# EAGLE design RJ11_BoshBaro_SiHyg (EAGLE 6.3)
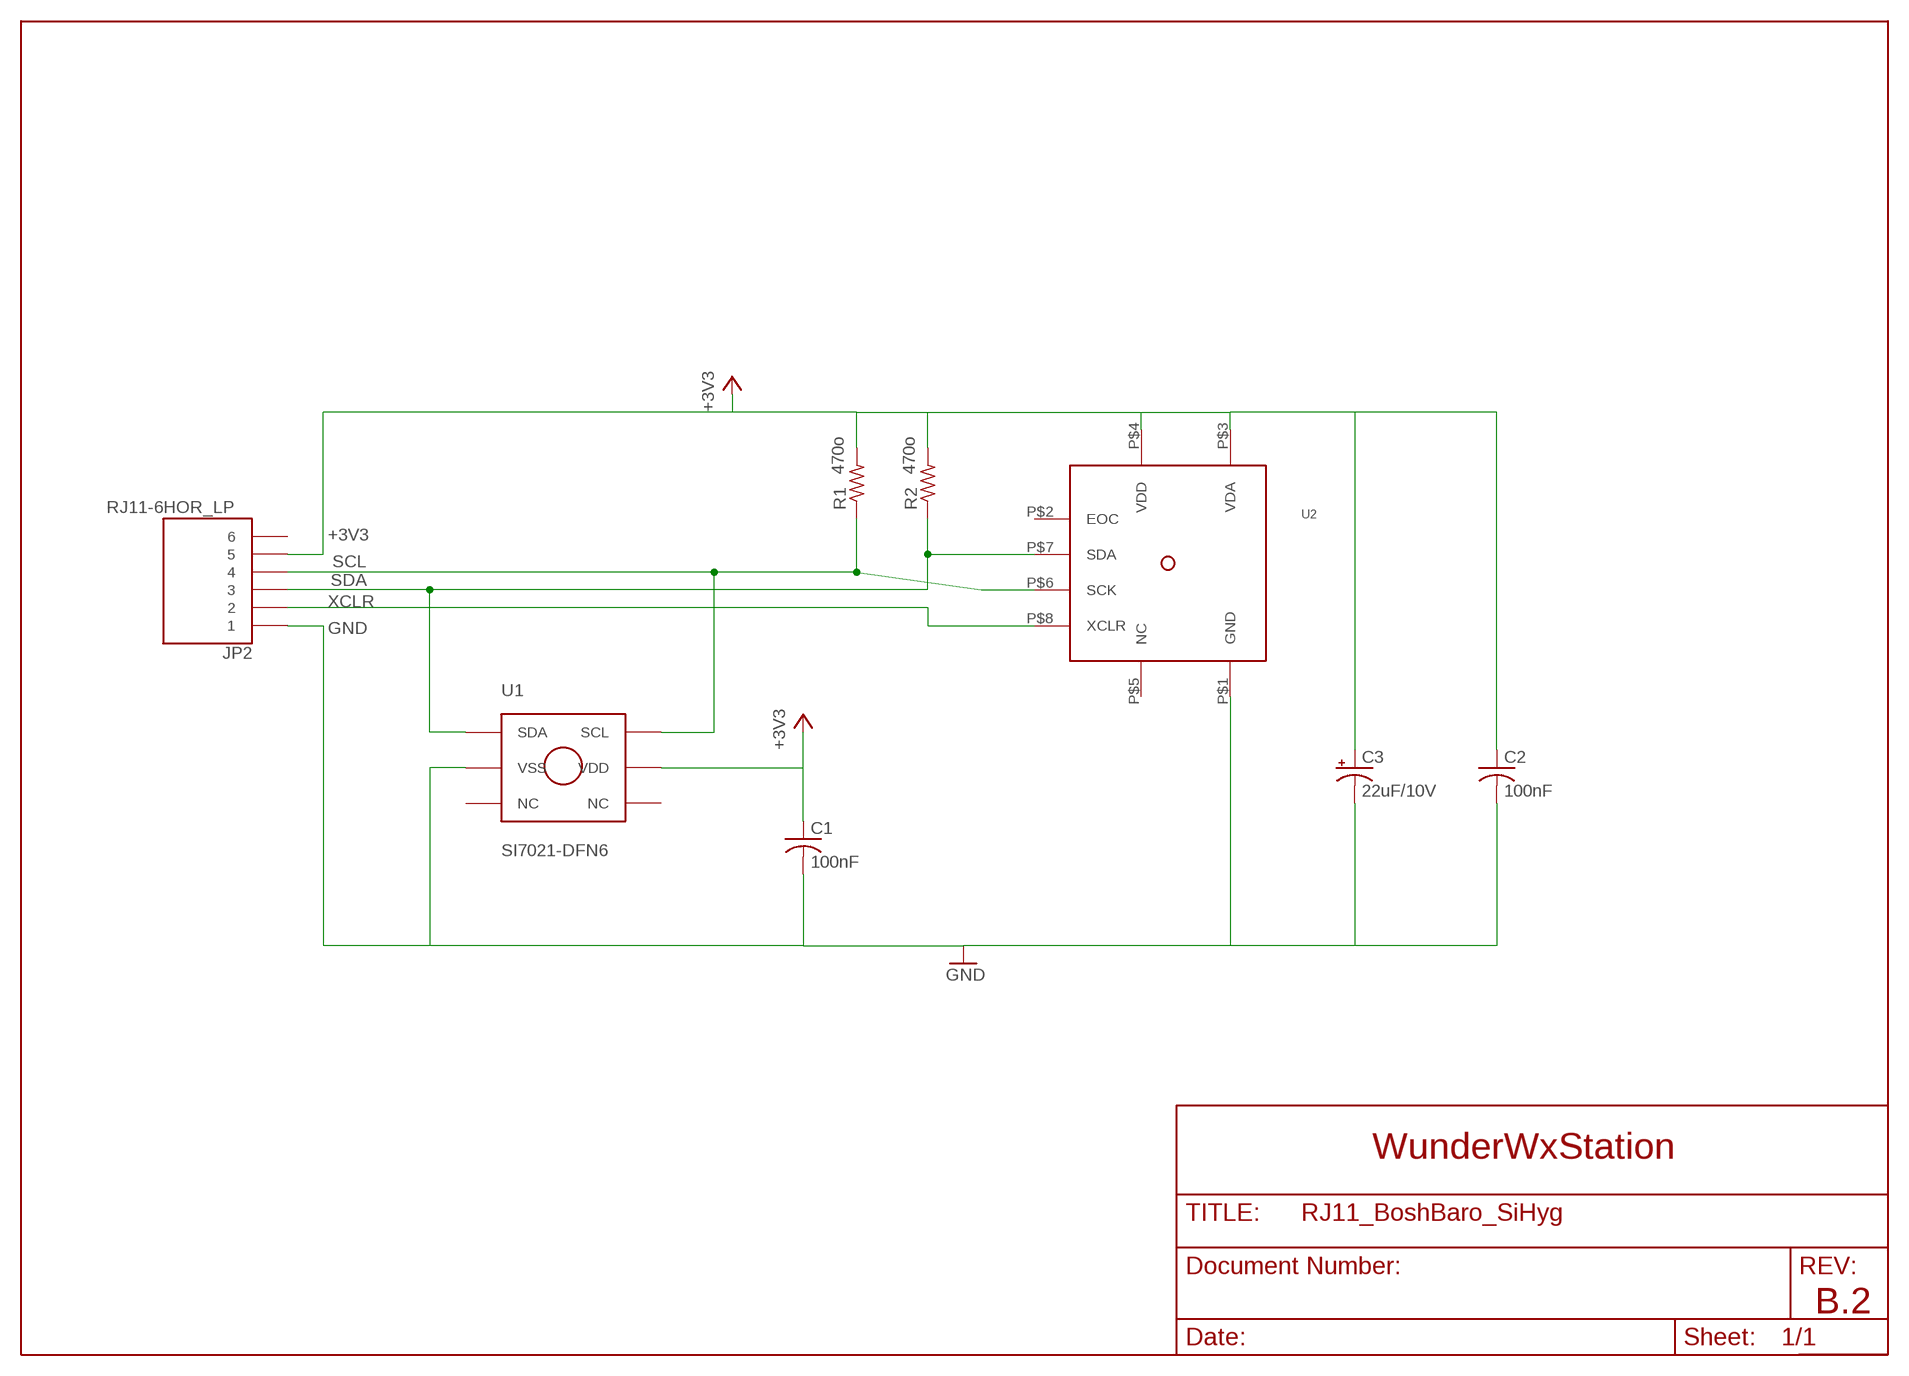
[diagram p0: schematic, sheet 1]

## Parts
C1  100nF  C-USC0805K  [C0805K]
C2  100nF  C-USC0805K  [C0805K]
C3  22uF/10V  CPOL-USSMCB  [SMC_B]
JP2  RJ11-6HOR_LP  [RJ11_HOR_LP]
R1  470o  R-US_R0603  [R0603]
R2  470o  R-US_R0603  [R0603]
U1  SI7021-DFN6  [DFN-6_SILABS]
U2  BMP085  [LCC8]

## Nets
+3V3: C1.1 C2.1 C3.+ JP2.P$5 R1.2 R2.2 U1.P$5(VDD) U2.P$3(VDA) U2.P$4(VDD)
GND: C1.2 C2.2 C3.- JP2.P$1 U1.P$2(VSS) U2.P$1(GND)
SCL: JP2.P$4 R1.1 U1.P$6(SCL) U2.P$6(SCK)
SDA: JP2.P$3 R2.1 U1.P$1(SDA) U2.P$7(SDA)
XCLR: JP2.P$2 U2.P$8(XCLR)
Unconnected: JP2.P$6 U1.P$3(NC) U1.P$4(NC) U2.P$2(EOC) U2.P$5(NC)

## Notes on the sheet
- WunderWxStation
- B.2

## Library data of the parts
C1 C2 = rcl:C-US: CAPACITOR, American symbol
C3 = rcl:CPOL-US: POLARIZED CAPACITOR, American symbol
JP2 = wifi_WX:RJ11-6: Cat3, RJ11 6 pin socket
R1 R2 = rcl:R-US_: RESISTOR, American symbol
U1 = wifi_WX:SI7021
U2 = 1AA_Stofer:BMP085

## Board
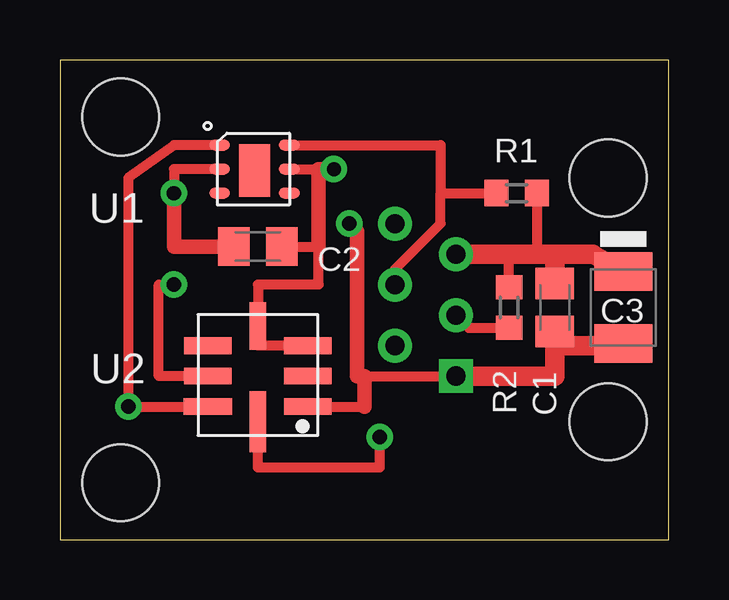
[diagram p1: board, top side]
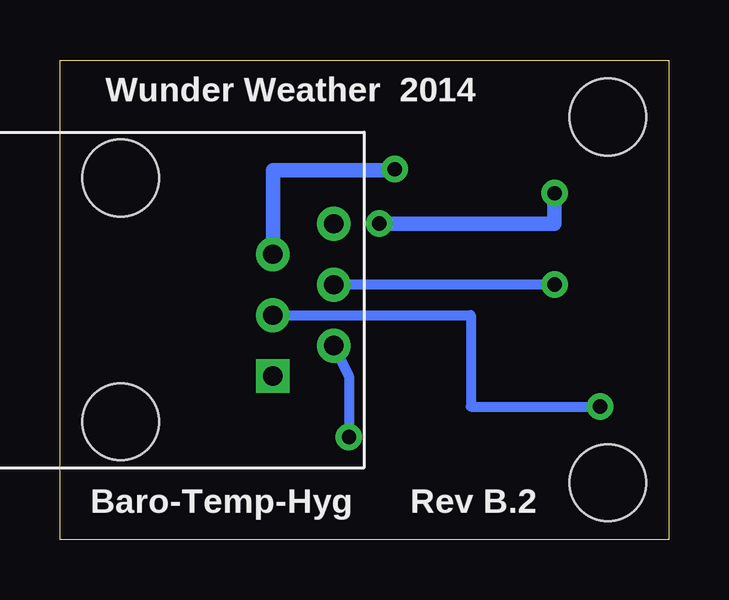
[diagram p2: board, bottom side, seen from below]

Size 25.38 x 19.99 mm. Coordinates in mm from the lower left corner, seen from the top.
Outline: 0,0 25.38,0 25.38,19.99 0,19.99 0,0
Copper layers (1*16): Top 0.035mm / dielectric 1.5mm / Bottom 0.035mm
Design rules "sparkfun": minimum track width 8mil, minimum drill 20mil, track to track 8mil, track to pad 8mil, pad to pad 8mil, via to via 8mil, smd to smd 8mil, copper to edge 10mil, drill to drill 8mil, minimum pad ring 12mil, minimum via ring 10mil, stop-mask expansion 4mil, vias tented up to drill 25mil, thermal gap 10mil
Holes 3.2 mm at 2.54,17.61 2.54,2.38

### Footprints (pad centres in the part's own frame; a part is rotated, then mirrored left to right if it is on the bottom)
C0805K = smd 1.3 x 1.6: 1 -1,0; 2 1,0
SMC_B = smd 1.6 x 2.4: + -1.5,0; - 1.5,0
RJ11_HOR_LP = drill 0.8 square: P$1 3.175,7.62 | drill 0.8: P$2 1.905,10.16; P$3 0.635,7.62; P$4 -0.635,10.16; P$5 -1.905,7.62; P$6 -3.175,10.16 | hole 3.2: -5.08,1.27; 5.08,1.27
R0603 = smd 1 x 1.1: 1 -0.85,0; 2 0.85,0
DFN-6_SILABS = smd 0.85 x 0.45: P$1 0,2; P$2 0,1; P$3 0,0; P$4 2.9,0; P$5 2.9,1; P$6 2.9,2 | smd 1.3 x 2.2: P$7 1.45,0.95
LCC8 = smd 1.981 x 0.7: P$1 -0.178,0; P$2 -0.178,-1.27; P$3 -0.178,-2.54; P$5 3.988,-2.54; P$6 3.988,-1.27 | smd 0.7 x 1.981: P$4 1.905,-3.353 | smd 2.007 x 0.7: P$7 3.988,0 | smd 0.7 x 2.55: P$8 1.905,0.635

### Placement (x,y rotation side)
C1  20.63,9.68 270 top
C2  8.25,12.22 180 top
C3  23.49,9.68 270 top
JP2  24.12,10 270 bottom
R1  19.05,14.44 0 top
R2  18.73,9.68 90 top
U1  6.66,14.44 0 top
U2  10.16,5.55 180 top

### Tracks (layer width: path | path; a pad name or v marks a point on that pad's centre or on a via)
+3V3  (via drill 0.6)
  Top 0.305: C1.1 20.95,10.68 | R2.2 18.41,10.53 | 8.25,8.09 U2.P$4
  Top 0.406: U1.P$5 10.79,15.44 | U2.P$3 8.25,8.09 | U2.P$4 8.25,10.63 10.79,10.63 10.79,12.22 C2.1 | R1.2 19.89,12.12 19.68,11.9 | R2.2 18.73,11.58 18.41,11.9 | 20.63,11.58 20.95,11.9
  Top 0.61: v11.43,15.44 10.79,15.44 10.79,12.22
  Top 0.813: JP2.P$5 18.41,11.9 19.68,11.9 20.95,11.9 22.22,11.9 C3.+ | C1.1 20.63,11.58
  Bottom 0.61: JP2.P$5 16.51,15.39 11.43,15.39 v11.43,15.44
GND  (via drill 0.6)
  Top 0.305: 12.7,6.82 12.38,6.82
  Top 0.406: U2.P$1 12.7,5.55 | 12.7,6.82 JP2.P$1 | U1.P$2 4.76,15.44 v4.76,14.44
  Top 0.61: 12.7,5.55 12.7,6.82 | C2.2 4.76,12.22 v4.76,14.44 | 12.38,6.82 12.38,12.85 v12.06,13.17
  Top 0.813: JP2.P$1 20.63,6.82 20.63,8.09 | 20.63,8.09 C1.2 | C3.- 23.4,8.09 20.63,8.09
  Bottom 0.61: v4.76,14.44 4.76,13.17 v12.06,13.17
SCL  (via drill 0.6)
  Top 0.406: U2.P$6 4.12,6.82 4.12,10.63 v4.76,10.63 | JP2.P$4 13.96,11.27 15.87,13.17 15.87,14.44 | 15.87,14.44 R1.1 | U1.P$6 15.87,16.44 15.87,14.44
  Bottom 0.406: v4.76,10.63 JP2.P$4
SDA  (via drill 0.6)
  Top 0.406: JP2.P$3 17.04,8.83 R2.1 | U1.P$1 4.76,16.44 2.85,15.08 v2.85,5.55 U2.P$7
  Bottom 0.406: JP2.P$3 8.25,9.36 8.25,5.55 v2.85,5.55
XCLR  (via drill 0.6)
  Top 0.406: v13.33,4.28 13.33,3.01 8.25,3.01 U2.P$8
  Bottom 0.406: JP2.P$2 13.33,6.82 v13.33,4.28

### Text on the board
tPlace: U2
bPlace: Wunder Weather 2014 | Rev B.2 | Baro-Temp-Hyg